# EAGLE design EFM32ZGUSB_H (EAGLE 6.6.0)
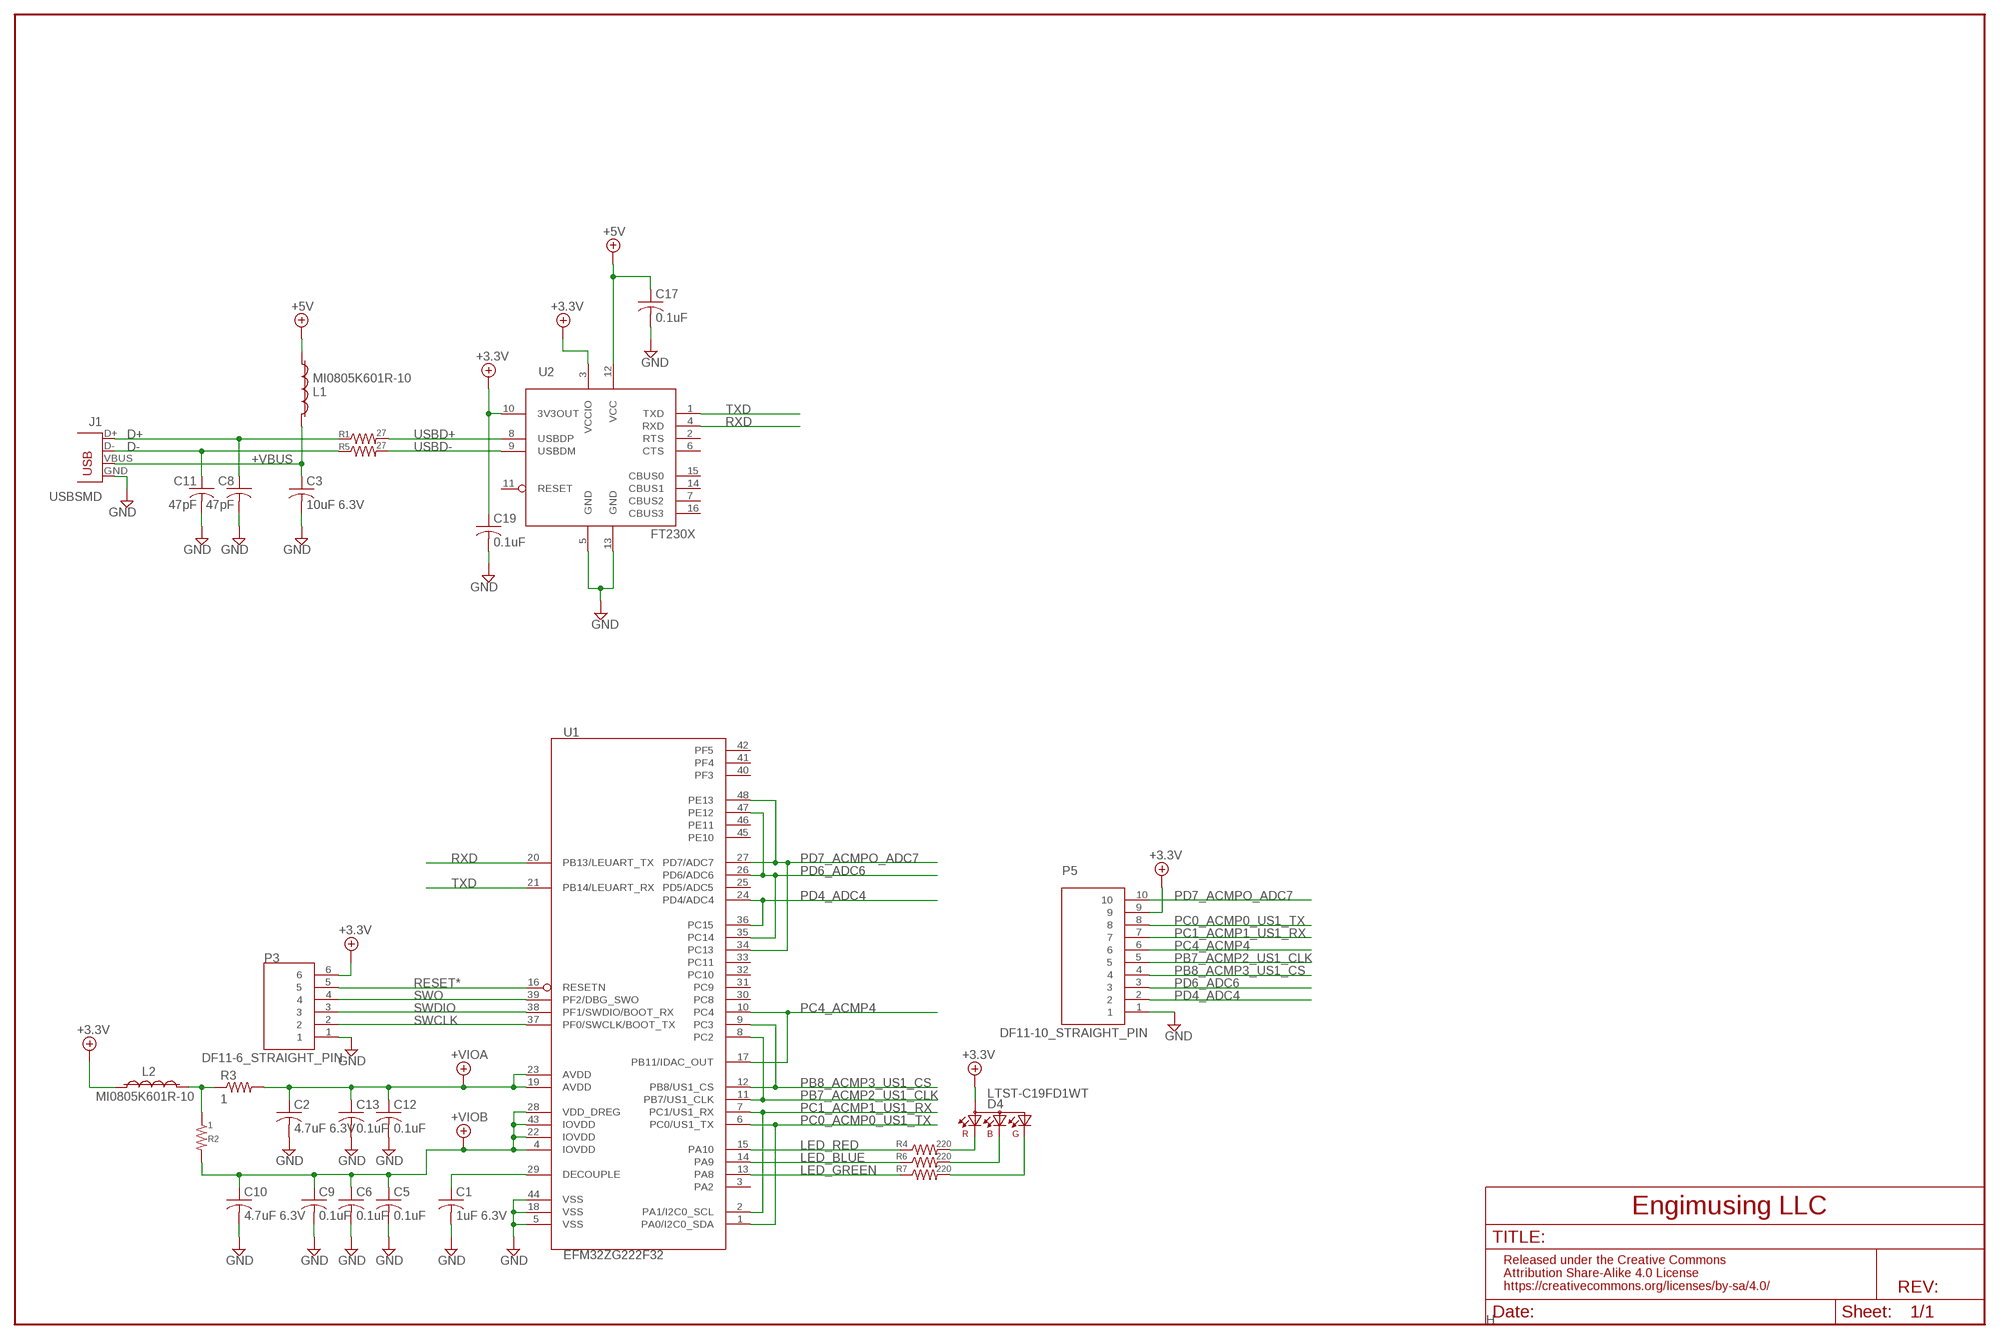
[diagram p0: schematic, sheet 1]
FRAME1 (TABLOID): DWG_NAME: EFM32ZGUSB; RV: H

## Parts
C1  1uF 6.3V  C-USC0603  [C0603]
C2  4.7uF 6.3V  C-USC0603  [C0603]
C3  10uF 6.3V  C-USC0603  [C0603]
C5  0.1uF  C-USC0402  [C0402]
C6  0.1uF  C-USC0402  [C0402]
C8  47pF  C-USC0603  [C0603]
C9  0.1uF  C-USC0402  [C0402]
C10  4.7uF 6.3V  C-USC0603  [C0603]
C11  47pF  C-USC0603  [C0603]
C12  0.1uF  C-USC0402  [C0402]
C13  0.1uF  C-USC0402  [C0402]
C17  0.1uF  C-USC0402  [C0402]
C19  0.1uF  C-USC0402  [C0402]
D4  LTST-C19FD1WT  [LED4]
J1  USBSMD  [USB-MINIB]
L1  MI0805K601R-10  FBEAD0805A  [L0805_2.5]
L2  MI0805K601R-10  FBEAD0805A  [L0805_2.5]
P3  DF11-6_STRAIGHT_PIN  [DF11SP-6-H]
P5  DF11-10_STRAIGHT_PIN  [DF11SP-10-H]
R1  27  R-USR0603  [R0603]
R2  1  R-USR0603  [R0603]
R3  1  R-USR0603  [R0603]
R4  220  R-USR0603  [R0603]
R5  27  R-USR0603  [R0603]
R6  220  R-USR0603  [R0603]
R7  220  R-USR0603  [R0603]
U1  EFM32ZG222F32  [QFP48]
U2  FT230X  [SSOP16]

## Nets
+3.3V: C19.1 D4.A4(A2) L2.1 P3.6 P5.9 U2.3(VCCIO) U2.10(3V3OUT)
+5V: C17.1 L1.1 U2.12(VCC)
+VBUS: C3.1 J1.VBUS L1.2
+VIOA: C2.1 C12.1 C13.1 R3.2 U1.19(AVDD) U1.23(AVDD)
+VIOB: C5.1 C6.1 C9.1 C10.1 R2.2 U1.4(IOVDD) U1.22(IOVDD) U1.28(VDD_DREG) U1.43(IOVDD)
D+: C8.1 J1.D+ R1.1
D-: C11.1 J1.D- R5.1
GND: C1.2 C2.2 C3.2 C5.2 C6.2 C8.2 C9.2 C10.2 C11.2 C12.2 C13.2 C17.2 C19.2 J1.GND P3.1 P5.1 U1.5(VSS) U1.18(VSS) U1.44(VSS) U2.5(GND) U2.13(GND)
LED_BLUE: R6.1 U1.14(PA9)
LED_GREEN: R7.1 U1.13(PA8)
LED_RED: R4.1 U1.15(PA10)
N$1: D4.G3(CGREEN) R7.2
N$2: D4.B1(CBLUE) R6.2
N$3: C1.1 U1.29(DECOUPLE)
N$4: L2.2 R2.1 R3.1
N$5: D4.R2(CRED) R4.2
PB7_ACMP2_US1_CLK: P5.5 U1.8(PC2) U1.11(PB7/US1_CLK)
PB8_ACMP3_US1_CS: P5.4 U1.9(PC3) U1.12(PB8/US1_CS)
PC0_ACMP0_US1_TX: P5.8 U1.1(PA0/I2C0_SDA) U1.6(PC0/US1_TX)
PC1_ACMP1_US1_RX: P5.7 U1.2(PA1/I2C0_SCL) U1.7(PC1/US1_RX)
PC4_ACMP4: P5.6 U1.10(PC4) U1.17(PB11/IDAC_OUT)
PD4_ADC4: P5.2 U1.24(PD4/ADC4) U1.36(PC15)
PD6_ADC6: P5.3 U1.26(PD6/ADC6) U1.35(PC14) U1.47(PE12)
PD7_ACMPO_ADC7: P5.10 U1.27(PD7/ADC7) U1.34(PC13) U1.48(PE13)
RESET*: P3.5 U1.16(RESETN)
RXD: U1.20(PB13/LEUART_TX) U2.4(RXD)
SWCLK: P3.2 U1.37(PF0/SWCLK/BOOT_TX)
SWDIO: P3.3 U1.38(PF1/SWDIO/BOOT_RX)
SWO: P3.4 U1.39(PF2/DBG_SWO)
TXD: U1.21(PB14/LEUART_RX) U2.1(TXD)
USBD+: R1.2 U2.8(USBDP)
USBD-: R5.2 U2.9(USBDM)
Unconnected: U1.3(PA2) U1.25(PD5/ADC5) U1.30(PC8) U1.31(PC9) U1.32(PC10) U1.33(PC11) U1.40(PF3) U1.41(PF4) U1.42(PF5) U1.45(PE10) U1.46(PE11) U2.2(RTS) U2.6(CTS) U2.7(CBUS2) U2.11(RESET) U2.14(CBUS1) U2.15(CBUS0) U2.16(CBUS3)

## Library data of the parts
C1-C3 C5 C6 C8-C13 C17 C19 = Engimusing:C-US: CAPACITOR, American symbol
D4 = Engimusing:LTST-C19FD1WT
J1 = Engimusing:USB: USB Connectors USB-B-PTH is fully proven SKU : PRT-00139/CONN-08278 USB-miniB is fully proven SKU : PRT-00587 USB-A-PCB is untested. USB-A-H is throughly reviewed, but untested. Spark Fun Electronics SKU : PRT-00437 USB-B-SMT is throughly reviewed, but untested. Needs silkscreen touching up. USB-A-S has not been used/tested USB-MB-H has not been used/tested USB-MICROB has been used. CONN-09505
L1 L2 = Engimusing:FBEAD: FERRITE BEAD
P3 = Engimusing:DF11-6: CONNEECTOR 6 POS SM
P5 = Engimusing:DF11-10: CONNECTOR 10 POS
R1-R7 = Engimusing:R-US: RESISTOR, American symbol
U1 = Engimusing:EFM32ZG222F32
U2 = Engimusing:FT230X: USB to RS232 Converter

## Net classes
2 gnd: width 0.254 mm, drill 0.61 mm, clearance 0.254 mm

## Board
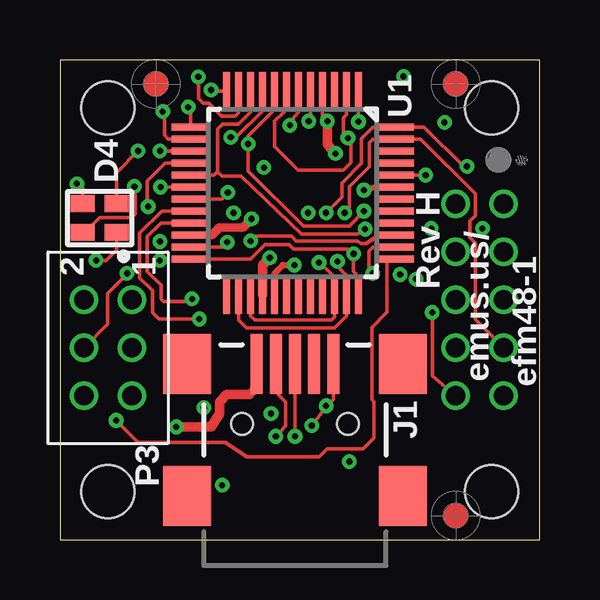
[diagram p1: board, top side]
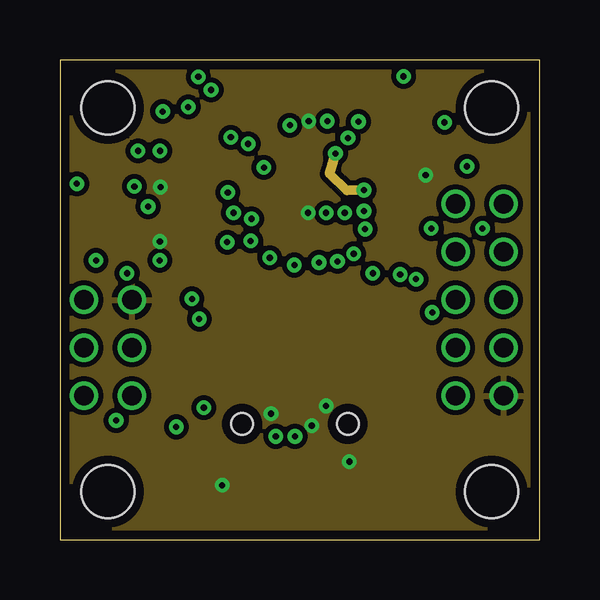
[diagram p2: board, inner layer GND]
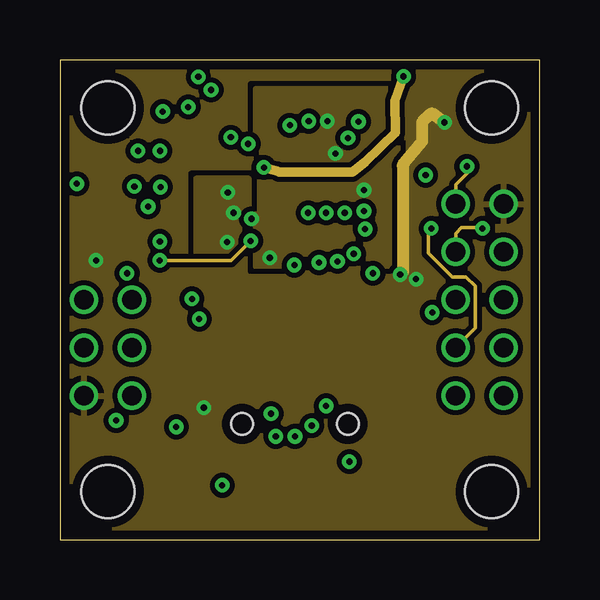
[diagram p3: board, inner layer Vout]
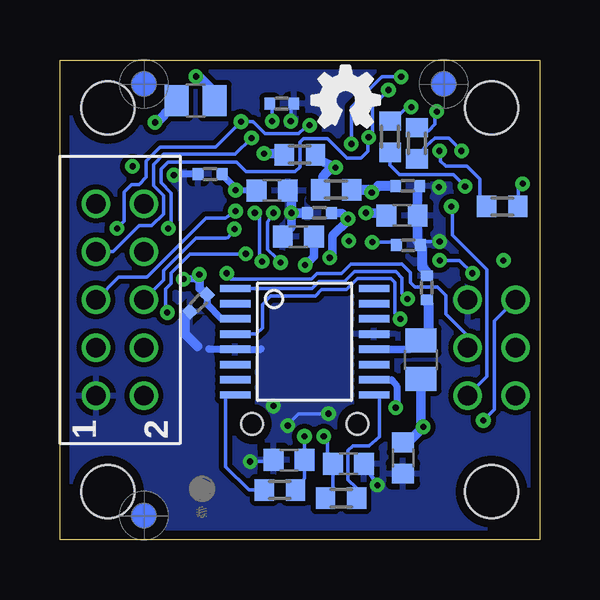
[diagram p4: board, bottom side, seen from below]

Size 20 x 20 mm. Coordinates in mm from the lower left corner, seen from the top.
Outline: 0,20 0,0 20,0 20,20 0,20
Copper layers (1*2*15*16): Top 0.035559375mm / dielectric 0.17018125mm / GND 0.01778125mm / dielectric 47mil / Vout 0.01778125mm / dielectric 0.17018125mm / Bottom 0.035559375mm
Design rules "OSHPark-4layer *": minimum track width 5mil, minimum drill 10mil, track to track 5mil, track to pad 5mil, pad to pad 5mil, via to via 5mil, smd to smd 5mil, copper to edge 15mil, drill to drill 6mil, minimum pad ring 4mil, minimum via ring 4mil, stop-mask expansion 2.5mil, vias tented up to drill 10mil, thermal gap 10mil
Holes 2.2 mm at 18,2 2,18 18,18 2,2

### Footprints (pad centres in the part's own frame; a part is rotated, then mirrored left to right if it is on the bottom)
C0603 = smd 0.825 x 0.925: 1 -0.65,0; 2 0.65,0
C0402 = smd 0.45 x 0.5: 1 -0.5,0; 2 0.5,0
LED4 = smd 1 x 0.7: A4 0.7,-0.6; B1 0.7,0.6; G3 -0.7,-0.6; R2 -0.7,0.6
USB-MINIB = smd 2.5 x 0.5: D+ 2.5,0; D- 2.5,0.8; GND 2.5,-1.6; ID 2.5,-0.8; VBUS 2.5,1.6 | smd 2.5 x 2: MTN1 -3,4.5; MTN2 2.5,4.5; MTN3 -3,-4.5; MTN4 2.5,-4.5 | hole 0.9: 0,2.2; 0,-2.2
L0805_2.5 = smd 1 x 1.3: 1 -0.8,0; 2 0.8,0
DF11SP-6-H = drill 0.8: 1 2,-1; 2 2,1; 3 0,-1; 4 0,1; 5 -2,-1; 6 -2,1
DF11SP-10-H = drill 0.8: 1 4,-1; 2 4,1; 3 2,-1; 4 2,1; 5 0,-1; 6 0,1; 7 -2,-1; 8 -2,1; 9 -4,-1; 10 -4,1
R0603 = smd 0.8 x 0.9: 1 -0.65,0; 2 0.65,0
QFP48 = smd 1.6 x 0.3: 1 -4.25,2.75; 2 -4.25,2.25; 3 -4.25,1.75; 4 -4.25,1.25; 5 -4.25,0.75; 6 -4.25,0.25; 7 -4.25,-0.25; 8 -4.25,-0.75; 9 -4.25,-1.25; 10 -4.25,-1.75; 11 -4.25,-2.25; 12 -4.25,-2.75; 25 4.25,-2.75; 26 4.25,-2.25; 27 4.25,-1.75; 28 4.25,-1.25; 29 4.25,-0.75; 30 4.25,-0.25; 31 4.25,0.25; 32 4.25,0.75; 33 4.25,1.25; 34 4.25,1.75; 35 4.25,2.25; 36 4.25,2.75 | smd 0.3 x 1.6: 13 -2.75,-4.25; 14 -2.25,-4.25; 15 -1.75,-4.25; 16 -1.25,-4.25; 17 -0.75,-4.25; 18 -0.25,-4.25; 19 0.25,-4.25; 20 0.75,-4.25; 21 1.25,-4.25; 22 1.75,-4.25; 23 2.25,-4.25; 24 2.75,-4.25; 37 2.75,4.25; 38 2.25,4.25; 39 1.75,4.25; 40 1.25,4.25; 41 0.75,4.25; 42 0.25,4.25; 43 -0.25,4.25; 44 -0.75,4.25; 45 -1.25,4.25; 46 -1.75,4.25; 47 -2.25,4.25; 48 -2.75,4.25
SSOP16 = smd 0.305 x 1.27: 1 -2.223,-2.896; 2 -1.587,-2.896; 3 -0.953,-2.896; 4 -0.318,-2.896; 5 0.318,-2.896; 6 0.953,-2.896; 7 1.587,-2.896; 8 2.223,-2.896; 9 2.223,2.896; 10 1.587,2.896; 11 0.953,2.896; 12 0.318,2.896; 13 -0.318,2.896; 14 -0.953,2.896; 15 -1.587,2.896; 16 -2.223,2.896

### Placement (x,y rotation side)
C1  10.06,12.64 180 bottom
C2  5.74,13.51 0 bottom
C3  5.7,3.4 270 bottom
C5  13.74,15.24 180 bottom
C6  10.75,18.18 0 bottom
C8  10.45,3.32 180 bottom
C9  9.18,13.62 180 bottom
C10  11.15,14.55 0 bottom
C11  7.97,3.16 0 bottom
C12  5.47,12.28 0 bottom
C13  5.5,14.75 0 bottom
C17  4.7,10.5 90 bottom
C19  14.23,9.86 225 bottom
D4  1.65,13.41 0 top
J1  9.8,4.83 90 top
L1  4.95,7.5 270 bottom
L2  14.34,18.3 0 bottom
P3  2,8 90 top
P5  17.5,10 270 bottom
R1  10.83,2.07 180 bottom
R2  10,16.05 180 bottom
R3  8.49,14.59 0 bottom
R4  1.56,13.89 0 bottom
R5  8.28,1.73 0 bottom
R6  5.12,16.52 270 bottom
R7  6.23,16.8 270 bottom
U1  9.7,14.45 270 top
U2  9.8,8.25 270 bottom
U$1  [LOGO_BULB]  18.9,15.9 90 top
U$5  [LOGO_BULB]  14,1.5 0 bottom
U$6  [OSHW_FILLX100_NOTEXT]  9.5,17.2 0 bottom
U$10  [FIDUCIAL_G10]  4,19 0 top
U$11  [FIDUCIAL_G10]  16.5,19 0 top
U$12  [FIDUCIAL_G10]  16.5,1 0 top
U$13  [FIDUCIAL_G10]  16.5,1 0 bottom
U$14  [FIDUCIAL_G10]  4,19 0 bottom
U$15  [FIDUCIAL_G10]  16.5,19 0 bottom

### Tracks (layer width: path | path; a pad name or v marks a point on that pad's centre or on a via)
+3.3V  (via drill 0.25 pad 0.61)
  Top 0.152: D4.A4 2.36,12.07 2.11,11.83 1.92,11.64 v1.5,11.64
  Vout 0.5: v16.04,17.39 15.5,17.77 15.45,17.75 15.1,17.4 15.1,16.6 14.32,15.69 14.3,15.57 14.3,11.18 14.19,11.06 v14.19,11.05
  Bottom 0.3: U2.3 13.25,9.2 13.87,9.82 C19.1 | v14.19,11.05 14.19,11.03 14.36,10.86 v14.85,10.86 | U2.10 6.16,6.66 5.95,6.4 5.95,5.55 v6,5.5
  Bottom 0.35: C19.1 14.18,10.47 v14.19,11.05
  Bottom 0.406: L2.1 15.36,18.49 15.33,18.04 15.98,17.39 v16.04,17.39
  pour Vout (isolate 0.21, rank 3): 20,20 0,20 0,0 20,0
+5V
  Bottom 0.305: U2.12 5.42,7.93 5.35,8.4 L1.1
  Bottom 0.406: C17.1 4.63,9.77 4.63,8.52 L1.1
+VBUS  (via drill 0.25 pad 0.61)
  Top 0.4: J1.VBUS 8.2,6.35 7.9,6.05 6.95,6.05 6.65,5.75 6.65,5.25 6.3,4.7 v4.85,4.7
  Bottom 0.4: L1.2 4.95,4.9 v4.85,4.7
  Bottom 0.406: C3.1 5.5,4.05 v4.85,4.7
+VIOA  (via drill 0.25 pad 0.61)
  Top 0.152: U1.19 6.75,14.2 v7,14.47 | U1.23 6.78,12.2 v6.97,12.4
  Bottom 0.152: C2.1 6.46,13.36 6.55,13.45 | C12.1 6.1,12.4 v6.97,12.4
  Bottom 0.4: v7.24,13.62 6.74,13.62 6.71,13.6 6.65,13.6 6.47,13.45 C2.1
  Bottom 0.406: R3.2 7.12,14.59 7.07,14.53 v7,14.47 6.72,14.75 C13.1
  pour Vout (isolate 0.21): 5.67,15.05 5.67,11.65 7.88,11.65 7.88,15.05
+VIOB  (via drill 0.25 pad 0.61)
  Top 0.152: U1.4 10.95,17.65 v11.15,17.45
  Top 0.25: U1.22 6.35,12.7 | U1.43 13.2,14.7 v12.68,14.57
  Top 0.35: 6.35,12.7 6.58,12.93 6.58,12.95 6.64,13.01 7.62,13.01 v7.99,13.38
  Top 0.4: U1.28 8.45,11.45 v8.75,11.75 | v11.15,17.45 11.15,16.47 v11.49,16.1
  GND 0.4: v11.49,16.1 11.24,15.26 11.97,14.55 12.1,14.56 v12.68,14.57
  Bottom 0.152: C6.1 11.15,18.07 v11.15,17.45
  Bottom 0.25: C10.1 12.62,14.55 v12.68,14.57
  Bottom 0.3: C5.1 12.71,14.69 v12.68,14.57
  Bottom 0.35: v8.75,11.75 8.63,11.9 8.63,12.67 7.99,13.31 v7.99,13.38 8.24,13.62 C9.1
  Bottom 0.4: R2.2 10.6,16.1 | 10.57,16.12 10.6,16.1 | 10.6,16.1 v11.49,16.1
  pour Vout (isolate 0.21, rank 2): 8.18,11.4 8.18,18.8 14.07,18.8 14.07,11.4
D+  (via drill 0.25 pad 0.61)
  Top 0.152: J1.D+ v9.8,4.3
  Bottom 0.152: v9.8,4.3 C8.1 9.8,2.56 R1.1
D-  (via drill 0.25 pad 0.61)
  Top 0.152: J1.D- 9.1,6.65 9.1,6.05 9.4,5.75 9.4,4.75 v9,4.3
  Bottom 0.152: v9,4.3 8.85,4.15 8.85,3.58 C11.1 8.62,2.11 R5.1
GND  (via drill 0.25 pad 0.61)
  Top 0.152: J1.GND 11.4,5.85 11.25,5.7 v11.1,5.58 11.05,5.5 v10.5,4.75 | U1.18 v4.19,14.7 | U1.5 10.45,17.6 v10.38,17.45 | U1.44 v15.25,15.2
  Bottom 0.152: C11.2 v6.77,2.26 | C12.2 4.87,12.43 v4.17,12.43 | C6.2 10.38,17.98 v10.38,17.45 | v10.5,4.75 10.5,4.8 10.05,5.25 v8.8,5.25 | v12.07,3.25 11.17,3.25 C8.2
  Bottom 0.3: 13.8,7.95 13.78,7.93 U2.5 11.62,7.93 11.6,7.95 | C5.2 15.16,15.24 v15.25,15.2
  Bottom 0.35: v10.35,13.62 10.35,13.04 C1.2
  Bottom 0.4: C13.2 5.09,14.51 C2.2 5.09,12.44 C12.2 | C9.2 10.32,13.62 10.35,13.65 | C10.2 10.35,14.15 10.35,13.65 | 10.35,13.65 v10.35,13.62
  Bottom 0.406: C17.2 4.7,11.14 4.89,11.33 4.89,12.14 C12.2 | C19.2 14.8,9.28 14.79,9.27 14.79,8.59 14.27,8.06
  pour GND (isolate 0.21): 20,20 0,20 0,0 20,0
  pour Bottom (isolate 0.21): 20,20 20,0 0,0 0,20
LED_BLUE  (via drill 0.25 pad 0.61)
  Top 0.152: U1.14 4.52,16.7 4.36,16.86 4.36,17.77 v4.29,17.85
  Bottom 0.152: R6.1 4.62,17.06 4.36,17.32 4.36,17.77 v4.29,17.85
LED_GREEN  (via drill 0.25 pad 0.61)
  Top 0.152: U1.13 5.45,17.9 v5.35,18.04
  Bottom 0.152: R7.1 6.1,17.45 5.54,18 5.39,18 v5.35,18.04
LED_RED  (via drill 0.25 pad 0.61)
  Top 0.152: U1.15 4.22,16.2 v4.17,16.21
  Bottom 0.152: v4.17,16.21 4.15,16.23 4.13,15.91 4.13,15.79 3.9,15.56 3.03,15.56 2.57,15.11 2.49,15.03 2.49,14.18 R4.1
N$1  (via drill 0.25 pad 0.61)
  Top 0.152: D4.G3 1.04,12.81 1.66,13.43 2.99,13.43 3.14,13.58 3.14,14.61 v3.1,14.72
  Bottom 0.152: R7.2 6.23,15.61 5.85,15.22 3.6,15.22 v3.1,14.72
N$2  (via drill 0.25 pad 0.61)
  Top 0.152: D4.B1 2.36,15.31 v3.26,16.21
  Bottom 0.152: v3.26,16.21 3.64,16.59 3.79,16.74 4.36,16.74 4.74,16.4 5.08,15.87 R6.2
N$3  (via drill 0.25 pad 0.61)
  Top 0.25: U1.29 8.95,11.1 9.3,11.45 v9.78,11.45
  Bottom 0.35: C1.1 9.41,11.81 v9.78,11.45
N$4  (via drill 0.25 pad 0.61)
  Vout 0.4: v8.5,15.52 9.07,15.36 9.09,15.35 9.12,15.33 9.13,15.32 12.2,15.32 12.72,15.75 13.99,16.96 13.97,18.3 v14.33,19.31
  Bottom 0.4: R2.1 9.42,15.93 9.11,15.81 v8.5,15.52 8.75,15.46 9.03,15.13 9.03,14.64 R3.1
  Bottom 0.406: L2.2 13.4,18.49 13.66,18.76 14.21,19.31 v14.33,19.31
N$5  (via drill 0.25 pad 0.61)
  Top 0.152: D4.R2 0.96,14.66 v0.7,14.84
  Bottom 0.152: R4.2 0.89,14.12 0.89,14.65 0.68,14.86 v0.7,14.84
PB7_ACMP2_US1_CLK  (via drill 0.25 pad 0.61)
  Top 0.152: U1.11 7.45,17.8 7.3,17.65 6.73,17.65 6.23,18.19 5.96,18.19 5.77,18.38 v5.77,19.3 | U1.8 8.95,17.93 7.85,16.82 v7.85,16.5 7.85,15.38 10.15,13.07 12.07,13.07 v12.68,13.7
  Bottom 0.152: 6.92,18.96 6.68,19.2 6.58,19.3 | 6.92,18.96 7.85,18.02 v7.85,16.5 | v12.68,13.7 13.1,13.4 13.91,13.4 16.36,10.95 17.55,10.95 P5.5 | 6.57,19.3 6.58,19.3 | v5.77,19.3 6.58,19.3 | 6.58,19.3 6.92,18.96
PB8_ACMP3_US1_CS  (via drill 0.25 pad 0.61)
  Top 0.152: U1.12 6.35,18.7 v6.3,18.75 | U1.9 8.45,17.88 7.35,16.77 v7.12,16.77
  Vout 0.152: P5.4 17.32,8.82 17.32,10.57 16.93,10.95 16.36,10.95 15.37,11.94 15.37,12.86 v15.49,12.97
  Bottom 0.152: v6.3,18.75 6.97,18.07 6.97,16.93 v7.12,16.77 7.15,16.75 7.15,16.2 7.45,15.9 8.04,15.9 8.85,16.71 9.85,16.71 10,16.56 10,15.54 10.2,15.34 12.24,15.34 12.64,15.74 15.5,15.74 15.79,15.45 15.79,14.88 15.37,14.46 15.37,13.09 v15.49,12.97
PC0_ACMP0_US1_TX  (via drill 0.25 pad 0.61)
  Top 0.152: U1.6 9.95,17.82 9.75,17.62 v9.59,17.28 | U1.1 v12.45,17.43
  Vout 0.152: P5.8 16.5,12.77 16.74,13.01 17.39,13.01 v17.62,12.97
  Bottom 0.152: v9.59,17.28 9.7,17.28 9.81,17.16 10.05,16.93 11.45,16.93 11.95,17.43 v12.45,17.43 13.51,16.37 15.83,16.37 16.4,15.79 16.4,15.11 16.71,14.8 17.01,14.8 17.32,14.5 17.32,13.28 v17.62,12.97
PC1_ACMP1_US1_RX  (via drill 0.25 pad 0.61)
  Top 0.152: U1.2 11.95,17.73 11.82,17.6 11.82,16.94 v12.01,16.75 12.13,16.63 12.13,15.71 11.83,15.41 9.92,15.41 8.95,16.38 8.95,17.44 9.38,17.87 9.38,17.93 9.45,18 U1.7
  Bottom 0.152: P5.7 18.48,12.02 17.77,12.02 16.71,13.09 16.17,13.09 15.68,13.58 15.68,14.34 16.1,14.76 16.1,15.64 15.67,16.07 12.69,16.07 v12.01,16.75
PC4_ACMP4  (via drill 0.25 pad 0.61)
  Top 0.152: v12.72,12.95 12.43,12.75 10.06,12.75 7.55,15.15 6.75,15.15 6.58,15.32 6.58,15.35 | U1.10 7.95,17.82 7.45,17.32 6.78,17.32 6.58,17.12 6.58,15.35 | 6.58,15.35 6.42,15.2 U1.17
  Bottom 0.152: v12.72,12.95 13,12.6 13.07,12.57 14.32,12.57 15.68,11.22 15.68,10.82 P5.6
PD4_ADC4  (via drill 0.25 pad 0.61)
  Top 0.152: v15.52,9.47 15.52,6.82 P5.2 | U1.36 12.45,10.98 12.25,11.18 v12.25,11.91 12.01,12.11 9.74,12.11 9.55,12.3 8.55,12.3 7.95,11.7 U1.24
  Bottom 0.152: v12.25,11.91 12.43,11.9 14.58,11.9 15.37,11.11 15.37,10.69 15.6,10.46 15.6,9.54 v15.52,9.47
PD6_ADC6  (via drill 0.25 pad 0.61)
  Top 0.152: U1.26 7.45,9.15 7.78,8.82 11.45,8.82 11.95,9.32 U1.35 11.95,11.04 11.79,11.18 11.57,11.4 v11.57,11.6 | v11.88,13.62 12.07,13.88 12.07,14.72 12.9,15.55 12.9,16.55 13.05,16.7 U1.47 15.04,16.7 17.32,14.42 17.32,13.5 17.09,13.28 17.09,12.59 17.32,12.36 17.32,9.19 P5.3
  Bottom 0.152: v11.57,11.6 11.6,11.65 11.62,11.68 11.65,11.69 11.68,11.75 11.68,13.43 v11.87,13.62 v11.88,13.62
PD7_ACMPO_ADC7  (via drill 0.25 pad 0.61)
  Top 0.152: U1.27 7.95,9.32 8.12,9.15 11.32,9.15 11.45,9.28 U1.34 11.45,10.95 11.18,11.22 10.98,11.41 v10.8,11.55 | v11.1,13.62 11.75,14.28 11.75,14.88 12.57,15.7 12.57,16.73 13.05,17.2 U1.48 15.18,17.2 16.82,15.56 v16.97,15.56
  Vout 0.152: P5.10 16.5,14.02 16.52,14.08 16.52,14.8 16.97,15.26 v16.97,15.56
  Bottom 0.152: v10.8,11.55 10.8,11.56 10.99,11.75 11.34,12.1 11.35,12.17 11.35,13.25 v11.1,13.62
RESET*  (via drill 0.25 pad 0.61)
  Top 0.152: U1.16 4.39,15.7 3.64,14.95 3.64,14.08 v3.67,13.89
  Bottom 0.152: P3.5 2.19,6.8 2.19,11.26 3.64,12.71 3.64,13.85 v3.67,13.89
RXD  (via drill 0.25 pad 0.61)
  Top 0.152: U1.20 4.25,13.7 3.33,12.78 3.33,10.91 3.87,10.38 3.87,9.47 4.13,9.2 v5.81,9.2
  Bottom 0.152: U2.4 11.81,8.57 11.56,8.82 11.56,9.81 11.22,10.15 9.35,10.15 9.09,10.42 8.06,10.42 7.6,10.88 6.19,10.88 6.04,10.72 6.04,9.43 v5.81,9.2
SWCLK  (via drill 0.25 pad 0.61)
  Top 0.152: U1.37 13.64,11.7 | 13.55,11.7 13.64,11.7 | 13.64,11.7 13.64,9.49 13,8.85 13,5.85 13.1,5.75 13.1,4.25 12.62,3.78 11.12,3.78 10.8,3.45 7.8,3.45 6.88,4.05 3.26,4.05 v2.34,4.97
  Bottom 0.152: P3.2 1.88,9.12 1.88,5.43 v2.34,4.97
SWDIO  (via drill 0.25 pad 0.61)
  Top 0.152: U1.38 13.05,12.2 12.88,12.03 12.88,11.39 12.88,11.35 v13.05,11.11
  Bottom 0.152: P3.3 3,8.5 3.9,9.4 3.9,10.18 4.26,10.54 5.2,10.54 5.39,10.72 5.39,11.14 5.73,11.49 7.87,11.49 8.27,11.09 9.29,11.09 9.51,10.87 12.89,10.87 v13.05,11.11
SWO  (via drill 0.25 pad 0.61)
  Top 0.152: U1.39 13.3,12.7 12.75,12.35 12.55,12.35 12.4,12.45 9.85,12.45 9.65,12.65 8.15,12.65 v7.95,12.45 | P3.4 2,9 2,10.27 2.8,11.07 v2.8,11.11
  Vout 0.152: v4.16,11.64 7.14,11.64 v7.95,12.45
  Bottom 0.152: v4.16,11.64 3.34,11.64 v2.8,11.11
TXD  (via drill 0.25 pad 0.61)
  Top 0.152: U1.21 4.21,13.2 3.64,12.63 3.64,11.18 4.21,10.61 4.21,10.04 4.32,9.92 5.62,9.92 v5.5,10.04
  Bottom 0.152: U2.1 9.49,10.47 9.2,10.76 8.13,10.76 7.71,11.18 6,11.18 5.73,10.91 5.73,10.27 v5.5,10.04
USBD+
  Bottom 0.152: U2.8 12.72,6.03 12.8,5.95 13.1,5.95 13.1,3.04 12.12,2.07 R1.2
USBD-
  Bottom 0.152: 6.65,6 6.52,6.03 U2.9 6.69,6 6.69,4.29 7.1,3.9 7.79,3.9 7.98,3.71 7.98,2.49 7.66,2.18 R5.2

### Text on the board
tPlace: Rev H | emus.us/ | efm48-1
Reference: Released under the Creative Commons Attribution Share-Alike 4.0 License / https://creativecommons.org/licenses/by-sa/3.0/ / Designed by: Joe George at Engimusing LLC
_bPlace: U$1 | U$3
_tNames: U1 | D4 | P3 | J1